# EAGLE design dermabragun_mentor_reno (EAGLE 9.6.2)
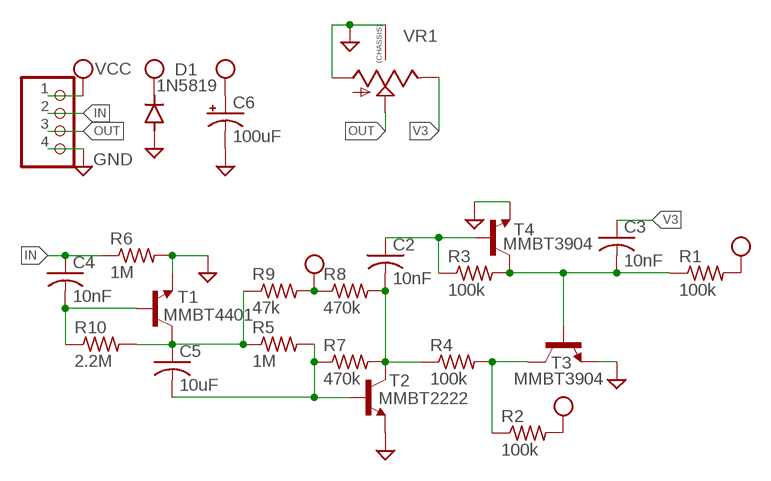
[diagram p0: schematic, sheet 1]

## Parts
C2  10nF  C-USC0603  [C0603]
C3  10nF  C-USC0603  [C0603]
C4  10nF  C-USC0603  [C0603]
C5  10uF  C-US_CHIP-1206(3216-METRIC)  [CAPC3216X135]
C6  100uF  100UF-POLAR-RADIAL-2.5MM-25V-20%  [CPOL-RADIAL-2.5MM-6.5MM]
D1  1N5819  DIODE-SOD123  [SOD123]
JP1  PINHD-1X4  [1X04]
R1  100k  R-US_R0603  [R0603]
R2  100k  R-US_R0603  [R0603]
R3  100k  R-US_R0603  [R0603]
R4  100k  R-US_R0603  [R0603]
R5  1M  R-US_R0603  [R0603]
R6  1M  R-US_R0603  [R0603]
R7  470k  R-US_R0603  [R0603]
R8  470k  R-US_R0603  [R0603]
R9  47k  R-US_R0603  [R0603]
R10  2.2M  R-US_R0603  [R0603]
T1  MMBT4401  BC808-NPN-SOT23-BEC  [SOT23-BEC]
T2  MMBT2222  MMBT2222ALT1-NPN-SOT23-BEC  [SOT23-BEC]
T3  MMBT3904  MMBT3904LT1-NPN-SOT23-BEC  [SOT23-BEC]
T4  MMBT3904  MMBT3904LT1-NPN-SOT23-BEC  [SOT23-BEC]
VR1  9MM_SNAP-IN_POT_CHASSIS  [9MM_SNAP-IN_POT]

## Nets
GND: C6.2(-) D1.A JP1.4 R6.2 T1.E T2.E T3.E T4.E VR1.1(A) VR1.CHASSIS1 VR1.CHASSIS2
IN: C4.1 JP1.2 R6.1
N$1: C4.2 R10.1 T1.B
N$2: C5.1 R5.1 R9.1 R10.2 T1.C
N$3: C5.2 R5.2 R7.1 T2.B
N$4: C2.2 R4.1 R7.2 R8.2 T2.C
N$5: C3.2 R1.1 R3.2 T3.B T4.C
N$6: C2.1 R3.1 T4.B
N$7: R2.1 R4.2 T3.C
OUT: JP1.3 VR1.2(S)
V3: C3.1 VR1.3(E)
VCC: C6.1(+) D1.C JP1.1 R1.2 R2.2 R8.1 R9.2

## Library data of the parts
C2-C4 = adafruit:C-US: CAPACITOR, American symbol
C5 = Capacitor:C-US: Capacitor - ANSI; CATEGORY: Capacitor
C6 = SparkFun-Capacitors:100UF-POLAR: 100µF polarized capacitors A capacitor is a passive two-terminal electrical component used to store electrical energy temporarily in an electric field.; PROD_ID: CAP-08439
D1 = diode:DIODE-: DIODE
JP1 = Connector:PINHD-1X4: PIN HEADER; CATEGORY: CONNECTOR; SUB-CATEGORY: PIN-HEADER
R1-R10 = adafruit:R-US_: RESISTOR, American symbol
T1-T4 = MusicThingModular:*-NPN-: NPN Transistror BF959 corrected 2008.03.06
VR1 = MusicThingModular:9MM_SNAP-IN_POT_CHASSIS: 9mm vertical snap-in pot, Alpha / Panasonic style, with a connection to the metal chassis for grounding

## Board
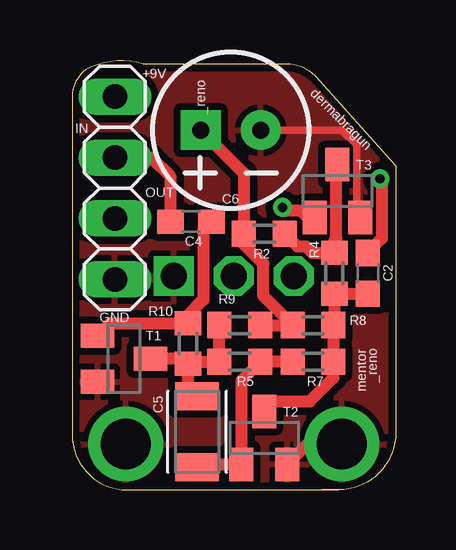
[diagram p1: board, top side]
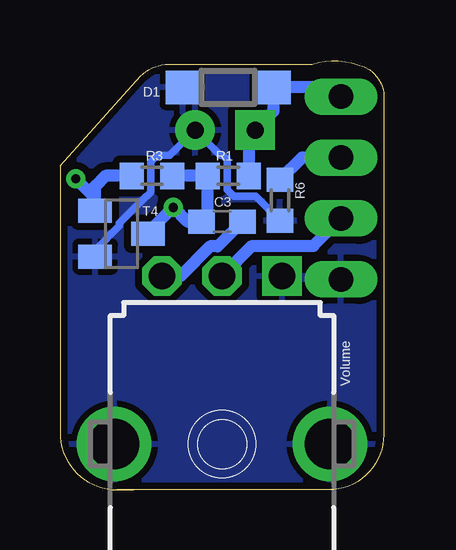
[diagram p2: board, bottom side, seen from below]

Size 13.48 x 17.87 mm. Coordinates in mm from the lower left corner, seen from the top.
Outline: 10.41,0 2.29,0 arc-90 0,2.29 0,16 0,16.54 arc-45 0.57,17.5 arc-45 2.96,17.74 8.95,17.73 arc-45 10.12,17.24 13.48,13.5
Outline: 10.41,0 11.12,0
Outline: 13.48,13.5 13.48,2.4 arc-45 12.78,0.69 arc-45 11.11,0 10.41,0
Copper layers (1*16): Top 0.035mm / dielectric 1.5mm / Bottom 0.035mm
Design rules "default *": minimum track width 6mil, minimum drill 0.35mm, track to track 6mil, track to pad 6mil, pad to pad 6mil, via to via 6mil, smd to smd 6mil, copper to edge 10mil, drill to drill 6mil, minimum pad ring 10mil, minimum via ring 8mil, stop-mask expansion 4mil, vias tented up to drill 0mil, thermal gap 10mil

### Footprints (pad centres in the part's own frame; a part is rotated, then mirrored left to right if it is on the bottom)
C0603 = smd 1.1 x 1: 1 -0.85,0; 2 0.85,0
CAPC3216X135 = smd 1.165 x 1.815: 1 -1.475,0; 2 1.475,0
CPOL-RADIAL-2.5MM-6.5MM = drill 0.7 pad 1.651 square: 1 1.25,0 | drill 0.7 pad 1.651: 2 -1.25,0
SOD123 = smd 1.4 x 1.4: A 1.9,0; C -1.9,0
1X04 = drill 1.016 long: 1 -3.81,0; 2 -1.27,0; 3 1.27,0; 4 3.81,0
R0603 = smd 1 x 1.1: 1 -0.85,0; 2 0.85,0
SOT23-BEC = smd 1 x 1.4: B -0.95,-1.1; C 0,1.1; E 0.95,-1.1
9MM_SNAP-IN_POT = drill 1.1 square: 1 -2.5,-7 | drill 1.1 octagon: 2 0,-7; 3 2.5,-7 | drill 2.1 pad 2.794: CHASSIS1 -4.5,0; CHASSIS2 4.5,0

### Placement (x,y rotation side)
C2  12.32,9.02 270 top
C3  6.73,11.18 180 bottom
C4  4.95,11.18 0 top
C5  5.21,2.41 270 top
C6  6.6,14.99 180 top
D1  6.48,16.76 180 bottom
JP1  1.78,12.57 270 top
R1  6.48,13.08 0 bottom
R2  8,10.67 180 top
R3  9.65,13.08 0 bottom
R4  10.92,9.02 90 top
R5  6.99,5.33 0 top
R6  4.32,12.06 270 bottom
R7  10.03,5.33 0 top
R8  10.03,6.86 0 top
R9  6.99,6.86 0 top
R10  4.83,6.1 270 top
T1  2.16,5.46 270 top
T2  8,2.16 0 top
T3  11.05,12.45 0 top
T4  10.92,10.67 270 bottom
VR1  6.73,1.91 180 bottom

### Tracks (layer width: path | path; a pad name or v marks a point on that pad's centre or on a via)
GND
  Top 0.305: T3.E 11.85,11.49 11.85,14.37 11.24,14.99 C6.2
  Top 0.508: T2.E 9.8,1.91 VR1.CHASSIS2
  Bottom 0.305: R6.2 5.33,12.23 6.25,12.23 6.52,12.49 6.52,13.76 6.7,13.94 6.8,13.94 C6.2 8.9,13.94 9.43,13.94 9.7,13.67 9.7,12.4 9.88,12.23 9.89,12.23 11.02,11.1 11.02,10.99 12.02,9.99 T4.E
  pour Top (isolate 0.305): -1.27,19.05 -1.27,-1.27 15.24,-1.27 15.24,19.05
  pour Bottom (isolate 0.305): -1.27,19.05 -1.27,-1.27 15.24,-1.27 15.24,19.05
IN
  Top 0.508: C4.1 4.1,13.04 3.3,13.84 JP1.2
  Bottom 0.508: JP1.2 3.39,13.84 R6.1
N$1
  Top 0.305: C4.2 5.46,10.84
  Top 0.508: T1.B 1.59,6.95 R10.1 4.83,7.28 5.46,7.91 5.46,10.84
N$2
  Top 0.508: R10.2 4.91,5.33 R5.1 R9.1 | R10.2 4.61,5.46 T1.C | C5.1 4.83,4.27 R10.2
N$3
  Top 0.508: C5.2 5.33,1.06 T2.B 7.05,4.55 R5.2 R7.1
N$4
  Top 0.508: T2.C 8.43,3.68 9.91,3.68 10.88,4.66 R7.2 R8.2 10.92,6.9 R4.1 C2.2
N$5  (via drill 0.38)
  Top 0.508: v8.76,11.76 8.9,11.62 9.52,11.62 9.8,11.35 T3.B
  Bottom 0.508: T4.C 9.82,10.71 v8.76,11.76 8.18,11.18 C3.2 7.33,11.43 R1.1 R3.2
N$6  (via drill 0.38)
  Top 0.508: C2.1 12.32,9.89 12.9,10.48 12.9,12.88 v12.83,12.95
  Bottom 0.508: T4.B 12.02,12.15 | 12.02,12.15 12.02,12.66 11.6,13.08 R3.1 | 12.02,12.15 v12.83,12.95
N$7
  Top 0.508: R2.1 9.38,10.14 9.74,10.14 10.01,9.87 R4.2 10.92,10.39 11.01,10.48 11.01,13.5 T3.C
OUT
  Bottom 0.508: VR1.2 5.48,10.16 2.92,10.16 JP1.3
V3
  Bottom 0.508: C3.1 6.92,10.14 7.24,10.14 8.47,8.9 VR1.3
VCC
  Top 0.508: R9.2 R8.1 7.96,8.08 7.96,9.41 7.15,10.23 R2.2 7.15,13.19 C6.1
  Bottom 0.508: R1.2 5.63,14.71 C6.1 4.58,15.76 D1.C 2.16,16.76 JP1.1

### Text on the board
tPlace: +9V | _reno | dermabragun | IN | OUT | GND | mentor | _reno
bPlace: Volume